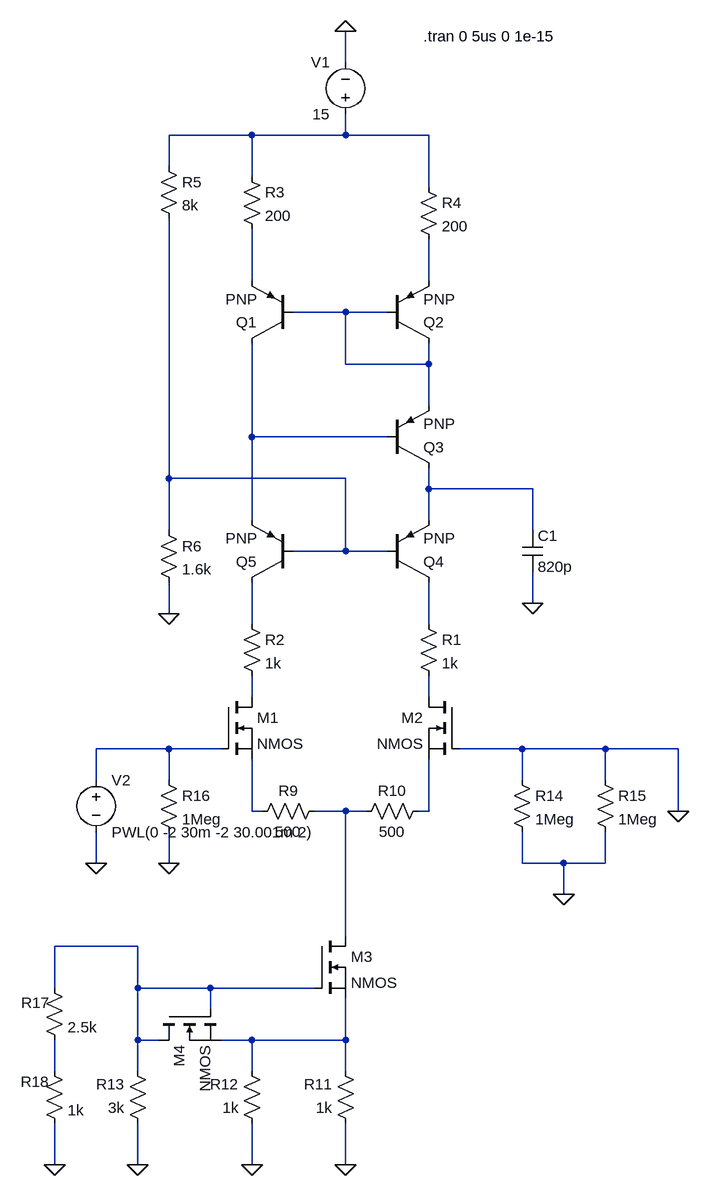
[diagram p0: schematic 6.asc]
6.asc, the LTspice schematic file:
Version 4
SHEET 1 912 1696
WIRE 384 -144 384 -192
WIRE 240 -32 112 -32
WIRE 384 -32 384 -64
WIRE 384 -32 240 -32
WIRE 512 -32 384 -32
WIRE 112 16 112 -32
WIRE 240 32 240 -32
WIRE 512 48 512 -32
WIRE 240 192 240 112
WIRE 512 192 512 128
WIRE 384 240 304 240
WIRE 448 240 384 240
WIRE 384 320 384 240
WIRE 512 320 512 288
WIRE 512 320 384 320
WIRE 512 384 512 320
WIRE 240 432 240 288
WIRE 448 432 240 432
WIRE 112 496 112 96
WIRE 384 496 112 496
WIRE 512 512 512 480
WIRE 672 512 512 512
WIRE 240 560 240 432
WIRE 512 560 512 512
WIRE 112 576 112 496
WIRE 672 576 672 512
WIRE 384 608 384 496
WIRE 384 608 304 608
WIRE 448 608 384 608
WIRE 672 688 672 640
WIRE 112 704 112 656
WIRE 240 720 240 656
WIRE 512 720 512 656
WIRE 240 832 240 800
WIRE 512 832 512 800
WIRE 112 912 0 912
WIRE 192 912 112 912
WIRE 656 912 560 912
WIRE 784 912 656 912
WIRE 896 912 784 912
WIRE 0 960 0 912
WIRE 112 960 112 912
WIRE 656 960 656 912
WIRE 784 960 784 912
WIRE 240 1008 240 928
WIRE 256 1008 240 1008
WIRE 384 1008 336 1008
WIRE 416 1008 384 1008
WIRE 512 1008 512 928
WIRE 512 1008 496 1008
WIRE 896 1008 896 912
WIRE 0 1088 0 1040
WIRE 112 1088 112 1040
WIRE 656 1088 656 1040
WIRE 720 1088 656 1088
WIRE 784 1088 784 1040
WIRE 784 1088 720 1088
WIRE 720 1136 720 1088
WIRE 384 1200 384 1008
WIRE 64 1216 -64 1216
WIRE -64 1280 -64 1216
WIRE 64 1280 64 1216
WIRE 176 1280 64 1280
WIRE 336 1280 176 1280
WIRE 176 1312 176 1280
WIRE 64 1360 64 1280
WIRE 96 1360 64 1360
WIRE 240 1360 192 1360
WIRE 384 1360 384 1296
WIRE 384 1360 240 1360
WIRE -64 1408 -64 1360
WIRE 64 1408 64 1360
WIRE 240 1408 240 1360
WIRE 384 1408 384 1360
WIRE -64 1552 -64 1488
WIRE 64 1552 64 1488
WIRE 240 1552 240 1488
WIRE 384 1552 384 1488
FLAG 112 704 0
FLAG 112 1088 0
FLAG 720 1136 0
FLAG 384 1552 0
FLAG 240 1552 0
FLAG 64 1552 0
FLAG 384 -192 0
FLAG 672 688 0
FLAG 896 1008 0
FLAG 0 1088 0
FLAG -64 1552 0
SYMBOL pnp 304 288 R180
SYMATTR InstName Q1
SYMBOL pnp 448 288 M180
SYMATTR InstName Q2
SYMBOL pnp 448 480 M180
SYMATTR InstName Q3
SYMBOL pnp 448 656 M180
SYMATTR InstName Q4
SYMBOL pnp 304 656 R180
SYMATTR InstName Q5
SYMBOL res 496 704 R0
SYMATTR InstName R1
SYMATTR Value 1k
SYMBOL res 224 704 R0
SYMATTR InstName R2
SYMATTR Value 1k
SYMBOL res 224 16 R0
SYMATTR InstName R3
SYMATTR Value 200
SYMBOL res 496 32 R0
SYMATTR InstName R4
SYMATTR Value 200
SYMBOL res 96 0 R0
SYMATTR InstName R5
SYMATTR Value 8k
SYMBOL res 96 560 R0
SYMATTR InstName R6
SYMATTR Value 1.6k
SYMBOL nmos 192 832 R0
SYMATTR InstName M1
SYMBOL nmos 560 832 M0
SYMATTR InstName M2
SYMBOL nmos 336 1200 R0
SYMATTR InstName M3
SYMBOL res 352 992 R90
WINDOW 0 0 56 VBottom 2
WINDOW 3 32 56 VTop 2
SYMATTR InstName R9
SYMATTR Value 500
SYMBOL res 512 992 R90
WINDOW 0 0 56 VBottom 2
WINDOW 3 32 56 VTop 2
SYMATTR InstName R10
SYMATTR Value 500
SYMBOL res 400 1504 R180
WINDOW 0 36 76 Left 2
WINDOW 3 36 40 Left 2
SYMATTR InstName R11
SYMATTR Value 1k
SYMBOL res 256 1504 R180
WINDOW 0 36 76 Left 2
WINDOW 3 36 40 Left 2
SYMATTR InstName R12
SYMATTR Value 1k
SYMBOL res 80 1504 R180
WINDOW 0 36 76 Left 2
WINDOW 3 36 40 Left 2
SYMATTR InstName R13
SYMATTR Value 3k
SYMBOL nmos 96 1312 M90
SYMATTR InstName M4
SYMBOL res 640 944 R0
SYMATTR InstName R14
SYMATTR Value 1Meg
SYMBOL res 768 944 R0
SYMATTR InstName R15
SYMATTR Value 1Meg
SYMBOL res 96 944 R0
SYMATTR InstName R16
SYMATTR Value 1Meg
SYMBOL voltage 384 -48 R180
WINDOW 0 24 96 Left 2
WINDOW 3 24 16 Left 2
SYMATTR InstName V1
SYMATTR Value 15
SYMBOL cap 656 576 R0
SYMATTR InstName C1
SYMATTR Value 820p
SYMBOL voltage 0 944 R0
SYMATTR InstName V2
SYMATTR Value PWL(0 -2 30m -2 30.001m 2)
SYMBOL res -80 1264 R0
WINDOW 0 -35 39 Left 2
SYMATTR InstName R17
SYMATTR Value 2.5k
SYMBOL res -80 1392 R0
WINDOW 0 -36 32 Left 2
SYMATTR InstName R18
SYMATTR Value 1k
TEXT 504 -184 Left 2 !.tran 0 5us 0 1e-15

The netlist it stands for:
* 6.asc
Q1 N005 N004 N002 0 PNP
Q2 N004 N004 N003 0 PNP
Q3 N007 N005 N004 0 PNP
Q4 N009 N006 N007 0 PNP
Q5 N008 N006 N005 0 PNP
R1 N009 N011 1k
R2 N008 N010 1k
R3 N001 N002 200
R4 N001 N003 200
R5 N001 N006 8k
R6 N006 0 1.6k
M1 N010 N012 N013 N013 NMOS
M2 N011 0 N015 N015 NMOS
M3 N014 N016 N017 N017 NMOS
R9 N014 N013 500
R10 N015 N014 500
R11 0 N017 1k
R12 0 N017 1k
R13 0 N016 3k
M4 N016 N016 N017 N017 NMOS
R14 0 0 1Meg
R15 0 0 1Meg
R16 N012 0 1Meg
V1 N001 0 15
C1 N007 0 820p
V2 N012 0 PWL(0 -2 30m -2 30.001m 2)
R17 N016 N018 2.5k
R18 N018 0 1k
.model NPN NPN
.model PNP PNP
.lib standard.bjt
.model NMOS NMOS
.model PMOS PMOS
.lib standard.mos
.tran 0 5us 0 1e-15
.backanno
.end